# Altium schematic sheet Outputs_SCH.SchDoc
size A
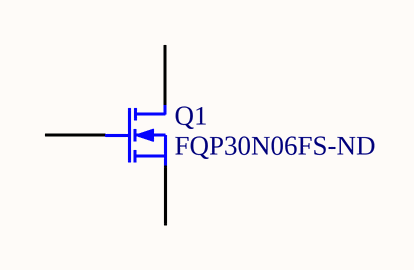
[diagram p0: Outputs_SCH.SchDoc]

## Parts
Q1  FQP30N06FS-ND  [E3]

## Nets

Not connected (* = marked no-connect by the designer): Q1 1(D) 2(G) 3(S)

## Library data of the parts
Q1 = MOSFET-N: N-Channel MOSFET; Published: 8-Jun-2000; LatestRevisionDate: 17-Jul-2002; LatestRevisionNote: Re-released for DXP Platform.; PackageVersion: 1995/1996; PackageReference: E3; Publisher: Altium Limited; PackageDescription: TO, Flat Index; 3 In-Line, Axial Leads; Body Dia. 4.6mm; Lead Dia. 0.5 mm (max)